# EAGLE design Calvos_Proyectointegrador (EAGLE 9.7.0)
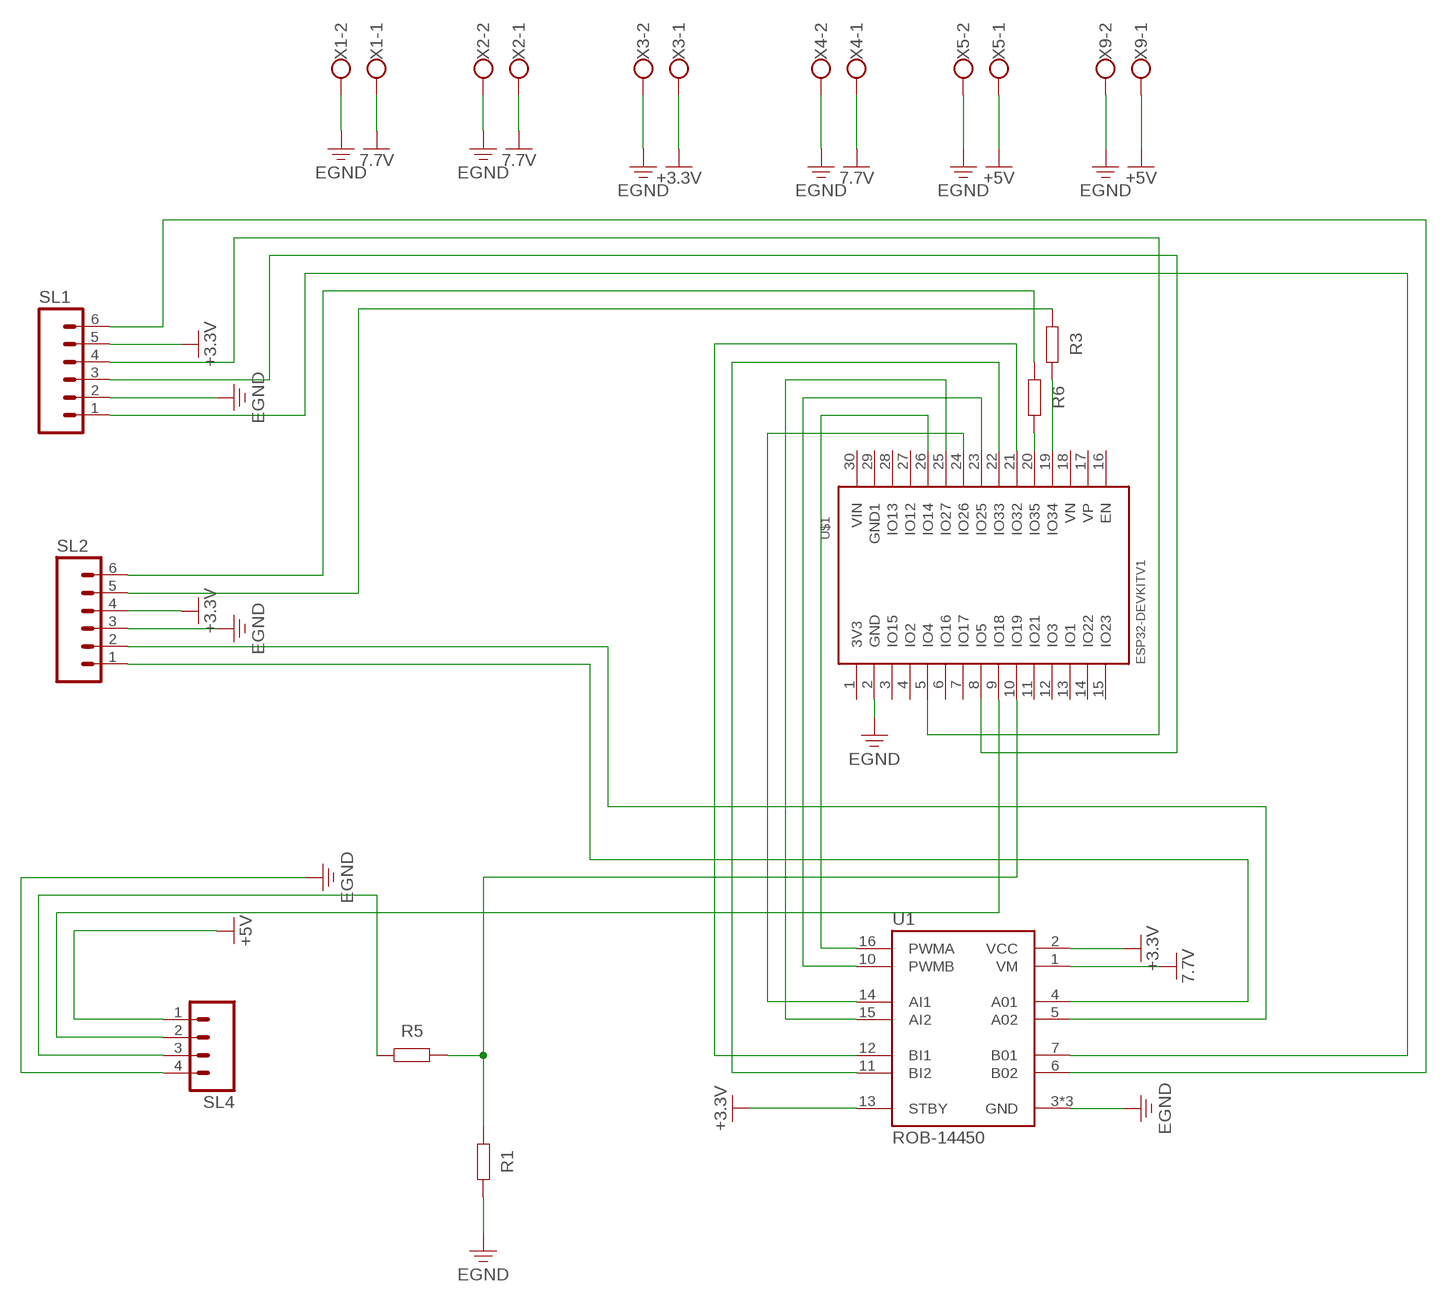
[diagram p0: schematic, sheet 1]

## Parts
R1  R_AXIAL-7.2MM-PITCH  [RESAD724W46L381D178B]
R3  R_AXIAL-7.2MM-PITCH  [RESAD724W46L381D178B]
R5  R_AXIAL-7.2MM-PITCH  [RESAD724W46L381D178B]
R6  R_AXIAL-7.2MM-PITCH  [RESAD724W46L381D178B]
SL1  M06  [06P]
SL2  M06  [06P]
SL4  M04  [04P]
U1  ROB-14450  [MODULE_ROB-14450]
U$1  ESP32DEVKITV1  [ESP32-DEVKITV1]
X1  W237-102  [W237-102]
X2  W237-102  [W237-102]
X3  W237-102  [W237-102]
X4  W237-102  [W237-102]
X5  W237-102  [W237-102]
X9  W237-102  [W237-102]

## Nets
7.7V: U1.1(VM) X1.1 X2.1 X4.1
+3.3V: SL1.5 SL2.4 U1.2(VCC) U1.13(STBY) X3.1
+5V: SL4.1 X5.1 X9.1
EGND: R1.2 SL1.2 SL2.3 SL4.4 U1.3(GND) U1.8(GND) U1.9(GND) U$1.2(GND) X1.2 X2.2 X3.2 X4.2 X5.2 X9.2
N$1: SL1.6 U1.6(B02)
N$2: U1.16(PWMA) U$1.26(IO14)
N$3: U1.10(PWMB) U$1.23(IO25)
N$4: U1.15(AI2) U$1.25(IO27)
N$5: U1.14(AI1) U$1.24(IO26)
N$6: U1.12(BI1) U$1.21(IO32)
N$7: U1.11(BI2) U$1.22(IO33)
N$8: SL1.4 U$1.5(IO4)
N$9: SL1.3 U$1.8(IO5)
N$10: SL1.1 U1.7(B01)
N$11: R6.1 SL2.6
N$12: R3.1 SL2.5
N$13: SL2.2 U1.5(A02)
N$14: SL2.1 U1.4(A01)
N$15: SL4.2 U$1.9(IO18)
N$16: R1.1 R5.2 U$1.10(IO19)
N$17: R5.1 SL4.3
N$18: R6.2 U$1.20(IO35)
N$19: R3.2 U$1.19(IO34)
Unconnected: U$1.1(3V3) U$1.3(IO15) U$1.4(IO2) U$1.6(IO16) U$1.7(IO17) U$1.11(IO21) U$1.12(IO3) U$1.13(IO1) U$1.14(IO22) U$1.15(IO23) U$1.16(EN) U$1.17(VP) U$1.18(VN) U$1.27(IO12) U$1.28(IO13) U$1.29(GND1) U$1.30(VIN)

## Library data of the parts
R1 R3 R5 R6 = Resistor:R: Resistor Fixed - Generic; CATEGORY: Resistors; DESCRIPTION: Axial Resistor 7.24 mm pitch 3.81 mm body length 1.78 mm body diameter; PACKAGE_SIZE: Axial; PACKAGE_TYPE: Through Hole
SL1 SL2 = con-amp-quick:M06: AMP QUICK CONNECTOR; OC_FARNELL: unknown; OC_NEWARK: unknown
SL4 = con-amp-quick:M04: AMP QUICK CONNECTOR; OC_FARNELL: unknown; OC_NEWARK: unknown
U1 = ROB-14450:ROB-14450: Check availability <https://pricing.snapeda.com/parts/ROB-14450/SparkFun%20Electronics/view-part?ref=eda>; AVAILABILITY: In Stock; CHECK_PRICES: https://www.snapeda.com/parts/ROB-14450/SparkFun/view-part/?ref=eda; DESCRIPTION: TB6612FNG - Motor Controller/Driver Power Management Evaluation Board; MF: SparkFun Electronics; MP: ROB-14450; PACKAGE: None; PRICE: None; SNAPEDA_LINK: https://www.snapeda.com/parts/ROB-14450/SparkFun/view-part/?ref=snap
U$1 = BibliotecaESP32:ESP32DEVKITV1
X1-X5 X9 = con-wago-500:W237-102: WAGO SCREW CLAMP; MPN: 237-102; OC_FARNELL: unknown; OC_NEWARK: 70K9898

## Board
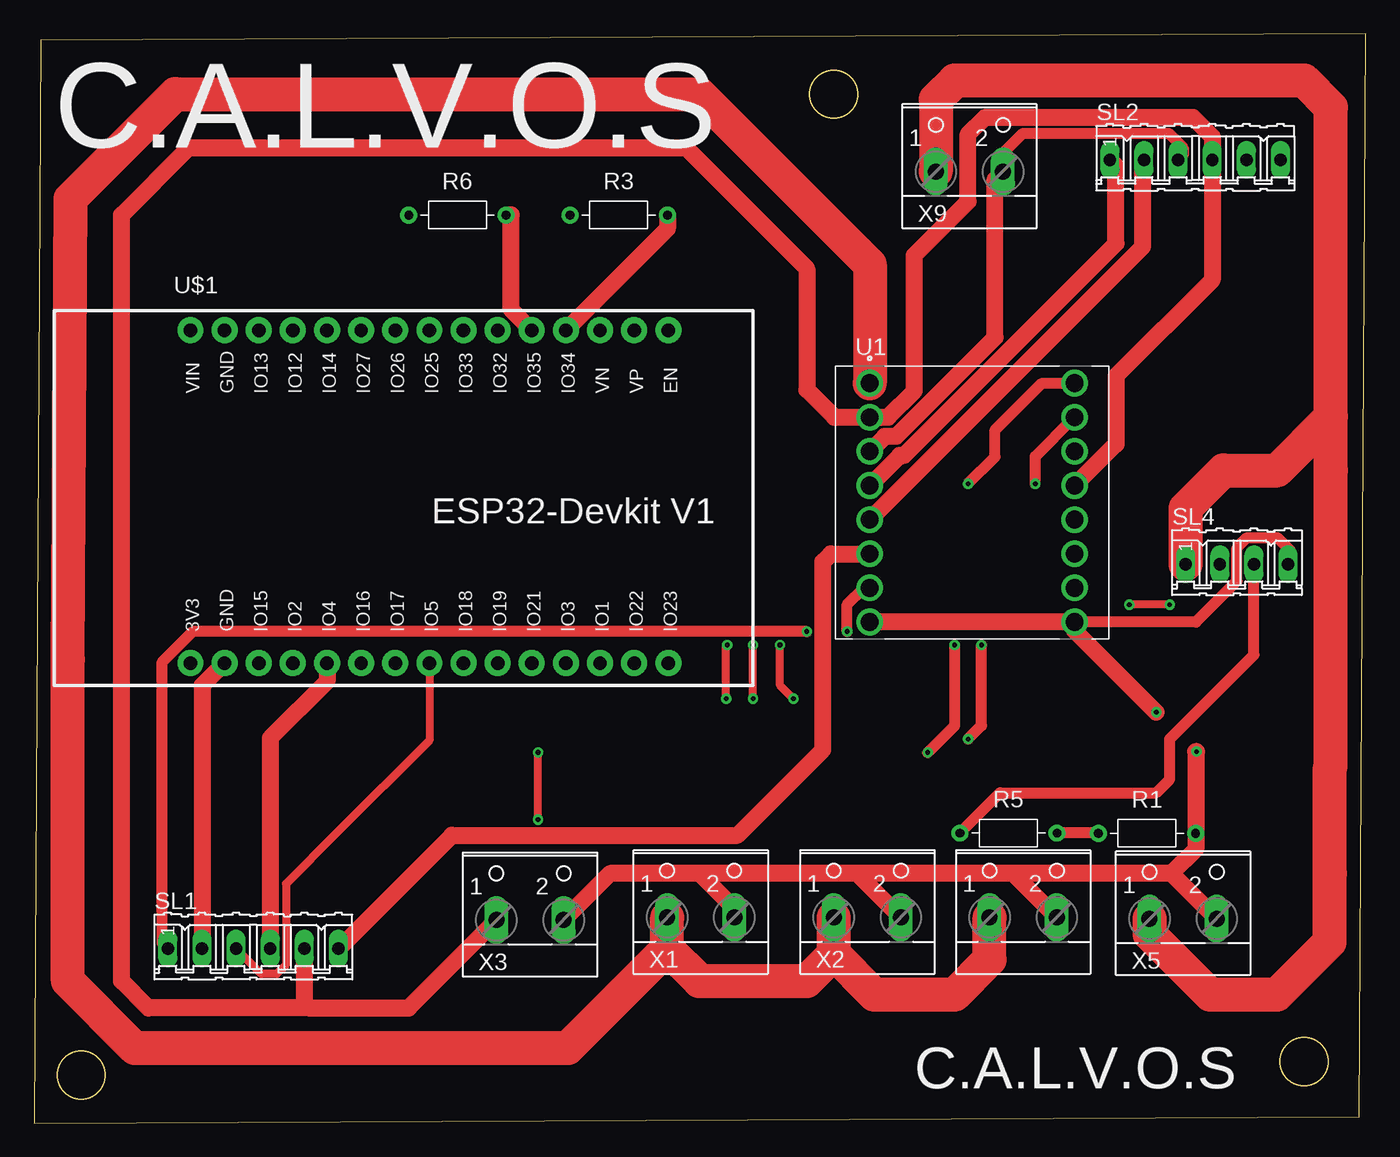
[diagram p1: board, top side]
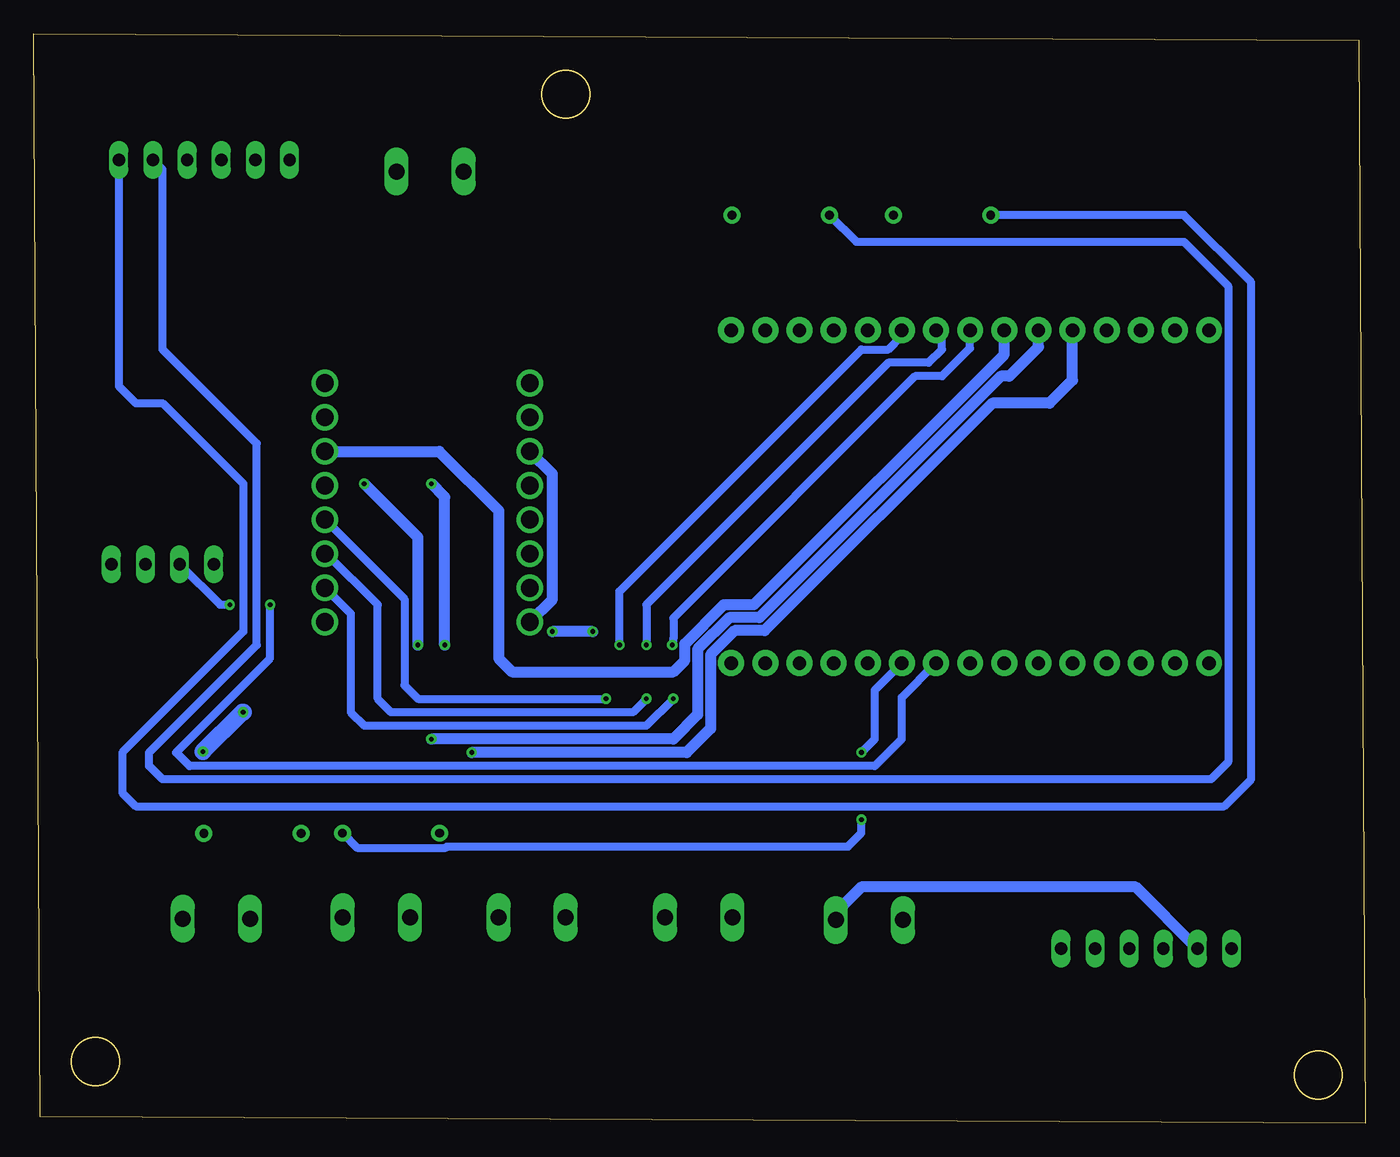
[diagram p2: board, bottom side, seen from below]

Size 99.1 x 81.1 mm. Coordinates in mm from the lower left corner, seen from the top.
Outline: 0,0 98.6,0.5 99.1,81.1 0.5,80.6 0,0
Outline: circle at 59.5,76.6 radius 1.77
Outline: circle at 94.5,4.6 radius 1.77
Outline: circle at 3.5,3.6 radius 1.77
Copper layers (1*16): Top 0.035mm / dielectric 1.5mm / Bottom 0.035mm
Design rules "Fusion Electronics Design Rules": minimum track width 6mil, minimum drill 0.35mm, track to track 6mil, track to pad 6mil, pad to pad 6mil, via to via 6mil, smd to smd 6mil, copper to edge 40mil, drill to drill 6mil, minimum pad ring 10mil, minimum via ring 8mil, stop-mask expansion 4mil, vias tented up to drill 9999mil, thermal gap 10mil

### Footprints (pad centres in the part's own frame; a part is rotated, then mirrored left to right if it is on the bottom)
RESAD724W46L381D178B = drill 0.66 pad 1.26: 1 -3.62,0; 2 3.62,0
06P = drill 0.914 long: 1 -6.35,0; 2 -3.81,0; 3 -1.27,0; 4 1.27,0; 5 3.81,0; 6 6.35,0
04P = drill 0.914 long: 1 -3.81,0; 2 -1.27,0; 3 1.27,0; 4 3.81,0
MODULE_ROB-14450 = drill 1.32: 1 -7.62,8.89; 2 -7.62,6.35; 3 -7.62,3.81; 4 -7.62,1.27; 5 -7.62,-1.27; 6 -7.62,-3.81; 7 -7.62,-6.35; 8 -7.62,-8.89; 9 7.62,-8.89; 10 7.62,-6.35; 11 7.62,-3.81; 12 7.62,-1.27; 13 7.62,1.27; 14 7.62,3.81; 15 7.62,6.35; 16 7.62,8.89
ESP32-DEVKITV1 = drill 1 pad 1.93: 1 -22.87,-13.54; 2 -20.33,-13.54; 3 -17.79,-13.54; 4 -15.25,-13.54; 5 -12.71,-13.54; 6 -10.17,-13.54; 7 -7.63,-13.54; 8 -5.09,-13.54; 9 -2.55,-13.54; 10 -0.01,-13.54; 11 2.53,-13.54; 12 5.07,-13.54; 13 7.61,-13.54; 14 10.15,-13.54; 15 12.69,-13.54; 16 12.69,11.23; 17 10.15,11.23; 18 7.61,11.23; 19 5.07,11.23; 20 2.53,11.23; 21 -0.01,11.23; 22 -2.55,11.23; 23 -5.09,11.23; 24 -7.63,11.23; 25 -10.17,11.23; 26 -12.71,11.23; 27 -15.25,11.23; 28 -17.79,11.23; 29 -20.33,11.23; 30 -22.87,11.23
W237-102 = drill 1.194 long: 1 -2.5,-1.27; 2 2.5,-1.27

### Placement (x,y rotation side)
R1  82.81,21.59 0 top
R3  43.5,67.6 0 top
R5  72.5,21.6 0 top
R6  31.5,67.6 0 top
SL1  16.3,13 0 top
SL2  86.4,71.7 0 top
SL4  89.5,41.6 0 top
U1  69.8,46.2 0 top
U$1  34.5,47.8 0 top
X1  49.6,16.6 0 top
X2  62,16.6 0 top
X3  36.9,16.4 0 top
X4  73.6,16.6 0 top
X5  85.5,16.5 0 top
X9  69.6,72.1 0 top

### Tracks (layer width: path | path; a pad name or v marks a point on that pad's centre or on a via)
7.7V
  Top 2.54: 47.1,13 X1.1 | 47.1,13 49.5,10.6 57.5,10.6 59.5,12.6 | 59.5,12.6 X2.1 | 59.5,12.6 62.5,9.6 68.5,9.6 71.1,12.2 X4.1 | 47.1,13 39.7,5.6 7.5,5.6 2.5,10.6 2.5,34.49 2.71,68.81 10.5,76.6 49.5,76.6 62.18,63.92 U1.1
+3.3V
  Top 1.27: X3.1 30.18,10.91 27.87,8.6 20.5,8.6 | 20.5,8.6 8.5,8.6 6.5,10.6 6.5,67.6 11.5,72.6 48.5,72.6 57.5,63.6 57.5,54.6 59.55,52.55 U1.2 63.55,52.55 65.5,54.5 65.5,64.6 69.5,68.6 69.5,73.6 70.78,74.88 86.22,74.88 87.67,73.43 SL2.4 87.67,62.77 80.5,55.6 80.5,50.55 U1.13 | SL1.5 20.11,8.99 20.5,8.6
+5V
  Top 2.54: X5.1 83,14.1 87.5,9.6 92.5,9.6 96.39,13.49 96.43,18.6 96.43,26.53 96.48,26.58 96.48,27.61 | 96.48,27.61 | SL4.1 85.69,45.79 88.5,48.6 92.5,48.6 96.5,52.6 | X9.1 67.1,76.2 68.5,77.6 94.5,77.6 96.5,75.6 96.5,52.6 | 96.48,27.61 96.48,48.58 96.5,48.6 96.5,52.6
EGND  (via drill 0.35)
  Top 0.813: U1.9 86.45,37.31 89.5,40.36 89.5,42.84 90.24,43.58 92.52,43.58 93.5,42.6 93.5,41.79 SL4.4 | X9.2 72.1,72.2 73.58,73.68 84.42,73.68 85.5,72.6 85.5,72.07 SL2.3
  Top 1.27: X3.2 42.87,18.6 49.5,18.6 | 49.5,18.6 52.1,16 X1.2 | 61.23,18.6 X2.2 | 61.23,18.6 49.5,18.6 | 72.83,18.6 X4.2 | 72.83,18.6 61.23,18.6 | X5.2 84.63,18.6 | 84.63,18.6 72.83,18.6 | 84.63,18.6 86.43,20.4 R1.2 86.43,27.67 v86.5,27.67 | U1.8 U1.9 77.42,36.68 v83.5,30.6 | U$1.2 12.49,32.58 SL1.2 | X9.2 71.5,70.23 71.5,58.49 64.14,51.13 63.3,51.13 U1.3
  Bottom 0.813: U1.8 60.5,38.99 60.5,48.33 U1.3 | SL1.2 17.09,17.6 37.5,17.6 39.4,15.7 X3.2
  Bottom 1.27: v86.5,27.67 83.57,30.6 v83.5,30.6
N$1
  Top 1.27: U1.6 59.29,42.39 58.69,41.79 58.69,27.79 52.33,21.43 31.08,21.43 SL1.6
N$2  (via drill 0.35)
  Top 0.813: v66.5,27.6 68.5,29.6 v68.5,35.6 | v69.5,47.6 71.5,49.6 71.5,51.6 74.99,55.09 U1.16
  Bottom 0.813: U$1.26 21.79,55.31 23.5,53.6 27.77,53.6 44.7,36.67 46.94,36.67 48.71,34.89 48.71,29.39 50.5,27.6 v66.5,27.6 | v68.5,35.6 68.5,46.6 v69.5,47.6
N$3  (via drill 0.35)
  Top 0.61: v51.5,31.6 51.5,35.52 v51.58,35.6
  Bottom 0.61: U1.10 75.5,37.93 75.5,30.6 74.5,29.6 53.5,29.6 v51.5,31.6 | v51.58,35.6 51.51,35.67 51.51,36.05 51.5,36.06 51.5,37.6 33.5,55.6 31.5,55.6 29.41,57.69 U$1.23
N$4  (via drill 0.35)
  Top 0.813: v69.5,28.6 70.5,29.6 v70.5,35.6 | v74.5,47.6 74.5,49.63 U1.15
  Bottom 0.813: U$1.25 24.33,57.77 26.5,55.6 27.14,55.6 45.1,37.63 47.34,37.63 49.68,35.29 49.68,30.42 51.5,28.6 v69.5,28.6 | v70.5,35.6 70.5,43.6 v74.5,47.6
N$5
  Bottom 0.813: U$1.24 26.87,57.23 45.5,38.6 47.73,38.6 50.64,35.69 50.64,34.46 51.5,33.6 63.5,33.6 64.5,34.6 64.5,45.6 68.91,50.01 U1.14
N$6  (via drill 0.35)
  Top 0.61: v56.5,31.6 55.5,32.6 v55.5,35.6
  Bottom 0.61: U1.12 71.5,39.01 71.5,32.6 70.5,31.6 v56.5,31.6 | v55.5,35.6 55.5,39.6 37.5,57.6 35.5,57.6 34.49,58.61 U$1.21
N$7  (via drill 0.35)
  Top 0.61: v53.5,31.6 v53.5,35.6
  Bottom 0.61: U1.11 77.29,42.39 73.5,38.6 73.5,31.6 72.5,30.6 54.5,30.6 v53.5,31.6 | v53.5,35.6 53.5,38.6 35.5,56.6 32.5,56.6 31.5,57.6 31.5,58.6 31.93,59.03 U$1.22
N$8
  Top 1.27: SL1.4 17.57,28.67 21.79,32.89 U$1.5
N$9
  Top 0.61: SL1.3 16.91,11.12 18.05,11.12 18.74,11.8 18.74,17.84 22.5,21.6 29.41,28.51 U$1.8
N$10  (via drill 0.35)
  Top 0.813: SL1.1 9.5,13.45 9.5,34.29 11.81,36.6 v57.5,36.6 | v60.5,36.6 60.5,38.6 61.75,39.85 U1.7
  Bottom 0.813: v57.5,36.6 v60.5,36.6
N$11
  Bottom 0.61: SL2.6 92.75,54.85 91.5,53.6 89.5,53.6 83.5,47.6 83.5,36.6 92.5,27.6 92.5,24.6 91.5,23.6 10.5,23.6 8.5,25.6 8.5,62.6 13.5,67.6 R6.1
N$12
  Bottom 0.61: R3.1 37.88,65.6 13.5,65.6 10.21,62.31 10.21,26.89 11.5,25.6 89.5,25.6 90.5,26.6 90.5,27.6 82.5,35.6 82.5,50.6 89.5,57.6 89.5,70.99 SL2.5
N$13
  Top 1.27: U1.5 82.5,65.25 82.5,71.61 SL2.2
N$14
  Top 1.27: SL2.1 80.5,71.25 80.5,65.48 64.73,49.7 64.42,49.7 U1.4
N$15  (via drill 0.35)
  Top 0.61: v84.5,38.6 v81.5,38.6
  Bottom 0.61: SL4.2 85.23,38.6 v84.5,38.6 | v81.5,38.6 81.5,34.6 88.5,27.6 87.5,26.6 36.5,26.6 34.5,28.6 34.5,31.71 U$1.9
N$16  (via drill 0.35)
  Top 0.61: v37.5,22.6 v37.5,27.6
  Top 0.813: R1.1 R5.2
  Bottom 0.61: R5.2 75.03,20.51 68.43,20.51 68.34,20.6 38.5,20.6 37.5,21.6 v37.5,22.6 | v37.5,27.6 36.5,28.6 36.5,32.25 U$1.10
N$17
  Top 0.813: SL4.3 90.77,34.87 84.5,28.6 84.5,25.6 83.5,24.6 71.88,24.6 R5.1
N$18
  Top 1.27: U$1.20 35.5,60.56 35.5,67.6 R6.2
N$19
  Top 1.27: U$1.19 47.12,66.58 R3.2

### Text on the board
tPlace: C.A.L.V.O.S | C.A.L.V.O.S